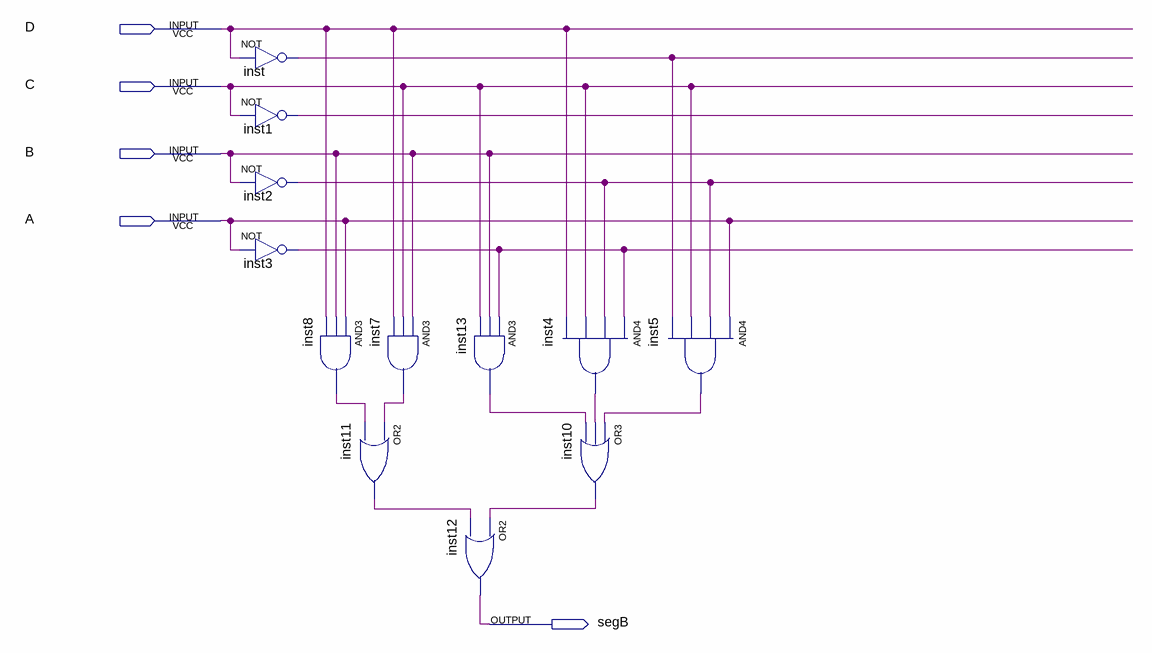
[diagram p0: schematic sheet]
// Quartus schematic segB.bdf as structural Verilog: 12 symbols, 5 pins
module segB (
  input  D,
  input  C,
  input  B,
  input  A,
  output segB
);

  wire inst1_out, inst2_out, inst3_out, inst4_out, inst5_out, inst7_out, inst8_out, inst10_out, inst11_out,
       inst13_out, inst_out;

  not inst (inst_out, D);
  not inst1 (inst1_out, C);
  not inst2 (inst2_out, B);
  not inst3 (inst3_out, A);
  and inst8 (inst8_out, A, B, D);
  and inst7 (inst7_out, B, C, D);
  or inst11 (inst11_out, inst7_out, inst8_out);
  and inst13 (inst13_out, inst3_out, B, C);
  or inst12 (segB, inst10_out, inst11_out);
  and inst4 (inst4_out, inst3_out, inst2_out, C, D);
  or inst10 (inst10_out, inst5_out, inst4_out, inst13_out);
  and inst5 (inst5_out, A, inst2_out, C, inst_out);
endmodule
